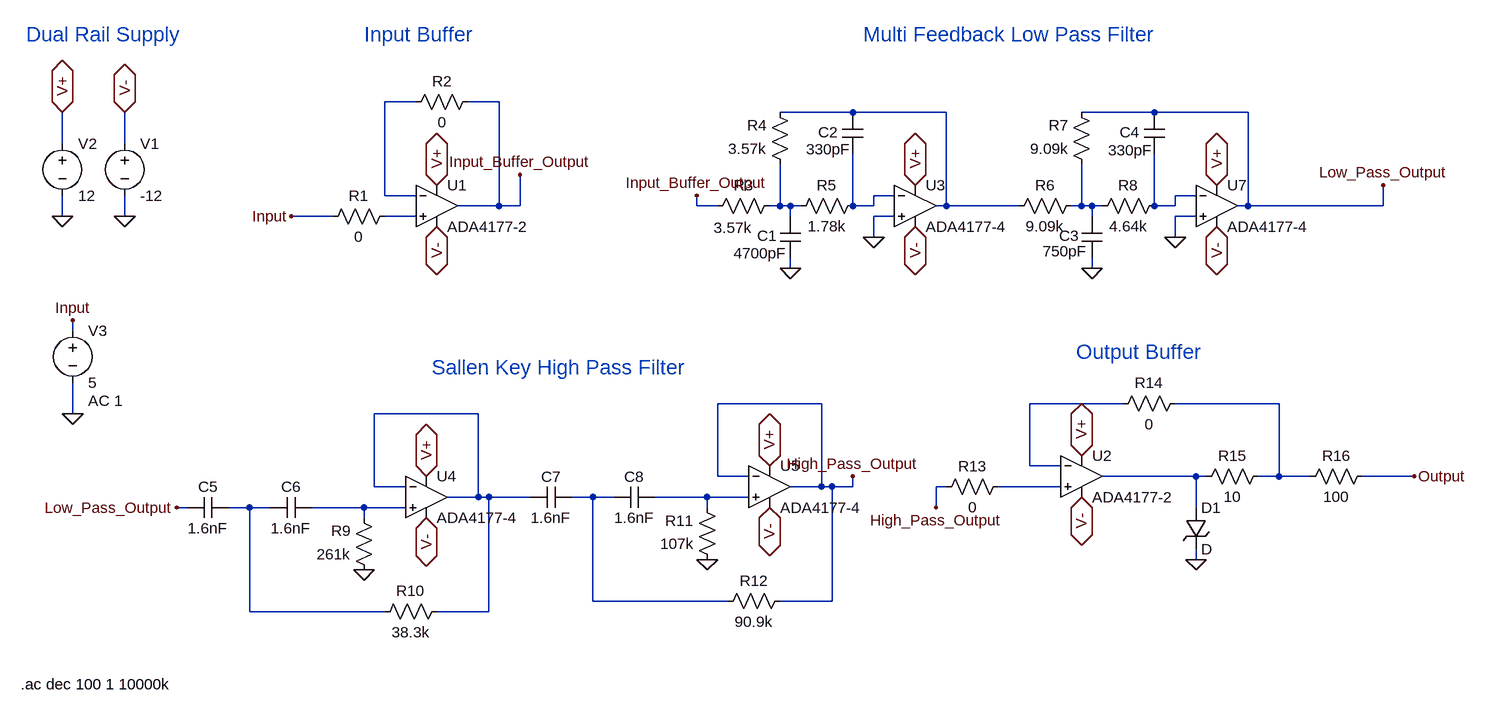
[diagram p0: schematic 8thOrderBandpassFilter.asc]
8thOrderBandpassFilter.asc, the LTspice schematic file:
Version 4.1
SHEET 1 1944 872
WIRE -192 -48 -240 -48
WIRE -64 -48 -112 -48
WIRE 480 -32 368 -32
WIRE 624 -32 480 -32
WIRE 944 -32 832 -32
WIRE 1088 -32 944 -32
WIRE -736 16 -736 -32
WIRE -640 16 -640 -32
WIRE -240 96 -240 -48
WIRE -192 96 -240 96
WIRE 544 96 512 96
WIRE 1008 96 976 96
WIRE -64 112 -64 -48
WIRE -64 112 -128 112
WIRE -32 112 -32 64
WIRE -32 112 -64 112
WIRE 240 112 240 96
WIRE 272 112 240 112
WIRE 368 112 368 48
WIRE 368 112 352 112
WIRE 384 112 368 112
WIRE 400 112 384 112
WIRE 480 112 480 32
WIRE 512 112 512 96
WIRE 512 112 480 112
WIRE 624 112 624 -32
WIRE 624 112 608 112
WIRE 736 112 624 112
WIRE 832 112 832 48
WIRE 832 112 816 112
WIRE 848 112 832 112
WIRE 864 112 848 112
WIRE 944 112 944 32
WIRE 976 112 976 96
WIRE 976 112 944 112
WIRE 1088 112 1088 -32
WIRE 1088 112 1072 112
WIRE 1296 112 1296 80
WIRE 1296 112 1088 112
WIRE -736 128 -736 96
WIRE -640 128 -640 96
WIRE -320 128 -384 128
WIRE -192 128 -240 128
WIRE 384 128 384 112
WIRE 544 128 512 128
WIRE 848 128 848 112
WIRE 1008 128 976 128
WIRE 512 160 512 128
WIRE 976 160 976 128
WIRE 384 208 384 192
WIRE 848 208 848 192
WIRE -720 304 -720 288
WIRE 432 416 272 416
WIRE 896 416 752 416
WIRE 1136 416 976 416
WIRE -720 432 -720 384
WIRE -96 432 -256 432
WIRE 752 512 752 416
WIRE 800 512 752 512
WIRE 272 528 272 416
WIRE 320 528 272 528
WIRE 1008 528 864 528
WIRE 1024 528 1008 528
WIRE 1136 528 1136 416
WIRE 1136 528 1104 528
WIRE 1184 528 1136 528
WIRE 1344 528 1264 528
WIRE -256 544 -256 432
WIRE -208 544 -256 544
WIRE 432 544 432 416
WIRE 432 544 384 544
WIRE 448 544 432 544
WIRE 480 544 480 528
WIRE 480 544 448 544
WIRE 624 544 608 544
WIRE 800 544 704 544
WIRE -96 560 -96 432
WIRE -96 560 -144 560
WIRE -80 560 -96 560
WIRE -16 560 -80 560
WIRE 80 560 48 560
WIRE 112 560 80 560
WIRE 256 560 176 560
WIRE 320 560 256 560
WIRE -544 576 -560 576
WIRE -448 576 -480 576
WIRE -416 576 -448 576
WIRE -272 576 -352 576
WIRE -208 576 -272 576
WIRE 256 576 256 560
WIRE 608 576 608 544
WIRE 1008 576 1008 528
WIRE -272 592 -272 576
WIRE 1008 656 1008 640
WIRE 80 720 80 560
WIRE 288 720 80 720
WIRE 448 720 448 544
WIRE 448 720 368 720
WIRE -448 736 -448 576
WIRE -240 736 -448 736
WIRE -80 736 -80 560
WIRE -80 736 -160 736
FLAG -736 128 0
FLAG -640 128 0
FLAG -736 -32 V+
IOPIN -736 -32 BiDir
FLAG -640 -32 V-
IOPIN -640 -32 BiDir
FLAG -160 80 V+
IOPIN -160 80 BiDir
FLAG 576 80 V+
IOPIN 576 80 BiDir
FLAG -176 528 V+
IOPIN -176 528 BiDir
FLAG 832 496 V+
IOPIN 832 496 BiDir
FLAG -160 144 V-
IOPIN -160 144 BiDir
FLAG 576 144 V-
IOPIN 576 144 BiDir
FLAG -176 592 V-
IOPIN -176 592 BiDir
FLAG 832 560 V-
IOPIN 832 560 BiDir
FLAG -384 128 Input
FLAG 512 160 0
FLAG 384 208 0
FLAG 1040 80 V+
IOPIN 1040 80 BiDir
FLAG 1040 144 V-
IOPIN 1040 144 BiDir
FLAG 976 160 0
FLAG 848 208 0
FLAG -272 672 0
FLAG 1296 80 Low_Pass_Output
FLAG -560 576 Low_Pass_Output
FLAG -32 64 Input_Buffer_Output
FLAG 240 96 Input_Buffer_Output
FLAG 352 512 V+
IOPIN 352 512 BiDir
FLAG 352 576 V-
IOPIN 352 576 BiDir
FLAG 256 656 0
FLAG 1008 656 0
FLAG 1344 528 Output
FLAG 480 528 High_Pass_Output
FLAG 608 576 High_Pass_Output
FLAG -720 288 Input
FLAG -720 432 0
SYMBOL OpAmps\\ADA4177-4 576 112 R0
SYMATTR InstName U3
SYMBOL OpAmps\\ADA4177-4 -176 560 R0
SYMATTR InstName U4
SYMBOL OpAmps\\ADA4177-2 -160 112 R0
SYMATTR InstName U1
SYMBOL OpAmps\\ADA4177-2 832 528 R0
SYMATTR InstName U2
SYMBOL voltage -640 0 R0
WINDOW 123 24 124 Left 2
WINDOW 39 0 0 Left 0
SYMATTR InstName V1
SYMATTR Value -12
SYMBOL voltage -736 0 R0
WINDOW 123 24 124 Left 2
WINDOW 39 0 0 Left 0
SYMATTR InstName V2
SYMATTR Value 12
SYMBOL res -336 144 R270
WINDOW 0 32 56 VTop 2
WINDOW 3 0 56 VBottom 2
SYMATTR InstName R1
SYMATTR Value 0
SYMBOL res -208 -32 R270
WINDOW 0 32 56 VTop 2
WINDOW 3 0 56 VBottom 2
SYMATTR InstName R2
SYMATTR Value 0
SYMBOL res 256 128 R270
WINDOW 0 32 56 VTop 2
WINDOW 3 -2 40 VBottom 2
SYMATTR InstName R3
SYMATTR Value 3.57k
SYMBOL res 384 64 R180
WINDOW 0 36 76 Left 2
WINDOW 3 36 40 Left 2
SYMATTR InstName R4
SYMATTR Value 3.57k
SYMBOL res 384 128 R270
WINDOW 0 32 56 VTop 2
WINDOW 3 0 56 VBottom 2
SYMATTR InstName R5
SYMATTR Value 1.78k
SYMBOL cap 400 192 R180
WINDOW 0 36 34 Left 2
WINDOW 3 21 7 Left 2
SYMATTR InstName C1
SYMATTR Value 4700pF
SYMBOL cap 464 -32 R0
WINDOW 0 -37 31 Left 2
WINDOW 3 -56 57 Left 2
SYMATTR InstName C2
SYMATTR Value 330pF
SYMBOL OpAmps\\ADA4177-4 1040 112 R0
SYMATTR InstName U7
SYMBOL res 720 128 R270
WINDOW 0 32 56 VTop 2
WINDOW 3 0 56 VBottom 2
SYMATTR InstName R6
SYMATTR Value 9.09k
SYMBOL res 848 64 R180
WINDOW 0 36 76 Left 2
WINDOW 3 36 40 Left 2
SYMATTR InstName R7
SYMATTR Value 9.09k
SYMBOL res 848 128 R270
WINDOW 0 32 56 VTop 2
WINDOW 3 0 56 VBottom 2
SYMATTR InstName R8
SYMATTR Value 4.64k
SYMBOL cap 864 192 R180
WINDOW 0 36 34 Left 2
WINDOW 3 23 10 Left 2
SYMATTR InstName C3
SYMATTR Value 750pF
SYMBOL cap 928 -32 R0
WINDOW 0 -37 31 Left 2
WINDOW 3 -55 58 Left 2
SYMATTR InstName C4
SYMATTR Value 330pF
SYMBOL res -256 752 R270
WINDOW 0 32 56 VTop 2
WINDOW 3 0 56 VBottom 2
SYMATTR InstName R10
SYMATTR Value 38.3k
SYMBOL res -256 688 R180
WINDOW 0 36 76 Left 2
WINDOW 3 36 40 Left 2
SYMATTR InstName R9
SYMATTR Value 261k
SYMBOL cap -480 560 R90
WINDOW 0 0 32 VBottom 2
WINDOW 3 32 32 VTop 2
SYMATTR InstName C5
SYMATTR Value 1.6nF
SYMBOL cap -352 560 R90
WINDOW 0 0 32 VBottom 2
WINDOW 3 32 32 VTop 2
SYMATTR InstName C6
SYMATTR Value 1.6nF
SYMBOL OpAmps\\ADA4177-4 352 544 R0
SYMATTR InstName U5
SYMBOL res 272 736 R270
WINDOW 0 32 56 VTop 2
WINDOW 3 0 56 VBottom 2
SYMATTR InstName R12
SYMATTR Value 90.9k
SYMBOL res 272 672 R180
WINDOW 0 36 76 Left 2
WINDOW 3 36 40 Left 2
SYMATTR InstName R11
SYMATTR Value 107k
SYMBOL cap 48 544 R90
WINDOW 0 0 32 VBottom 2
WINDOW 3 32 32 VTop 2
SYMATTR InstName C7
SYMATTR Value 1.6nF
SYMBOL cap 176 544 R90
WINDOW 0 0 32 VBottom 2
WINDOW 3 32 32 VTop 2
SYMATTR InstName C8
SYMATTR Value 1.6nF
SYMBOL res 608 560 R270
WINDOW 0 32 56 VTop 2
WINDOW 3 0 56 VBottom 2
SYMATTR InstName R13
SYMATTR Value 0
SYMBOL res 880 432 R270
WINDOW 0 32 56 VTop 2
WINDOW 3 0 56 VBottom 2
SYMATTR InstName R14
SYMATTR Value 0
SYMBOL res 1008 544 R270
WINDOW 0 32 56 VTop 2
WINDOW 3 0 56 VBottom 2
SYMATTR InstName R15
SYMATTR Value 10
SYMBOL res 1168 544 R270
WINDOW 0 32 56 VTop 2
WINDOW 3 0 56 VBottom 2
SYMATTR InstName R16
SYMATTR Value 100
SYMBOL TVSdiode 992 576 R0
SYMATTR InstName D1
SYMBOL voltage -720 288 R0
WINDOW 123 24 124 Left 2
WINDOW 39 0 0 Left 0
SYMATTR Value2 AC 1
SYMATTR InstName V3
SYMATTR Value 5
TEXT 496 -152 Left 3 ;Multi Feedback Low Pass Filter
TEXT -272 -152 Left 3 ;Input Buffer
TEXT -792 -152 Left 3 ;Dual Rail Supply
TEXT -168 360 Left 3 ;Sallen Key High Pass Filter
TEXT 824 336 Left 3 ;Output Buffer
TEXT -800 848 Left 2 !.ac dec 100 1 10000k

The netlist it stands for:
* 8thOrderBandpassFilter.asc
* U3: ADA4177-4 (symbol OpAmps\ADA4177-4 not available, pins judged from their places): In+=0 In-=N003 V+=V+ V-=V- OUT=N002
* U4: ADA4177-4 (symbol OpAmps\ADA4177-4 not available, pins judged from their places): In+=N016 In-=N010 V+=V+ V-=V- OUT=N010
* U1: ADA4177-2 (symbol OpAmps\ADA4177-2 not available, pins judged from their places): In+=N007 In-=N001 V+=V+ V-=V- OUT=Input_Buffer_Output
* U2: ADA4177-2 (symbol OpAmps\ADA4177-2 not available, pins judged from their places): In+=N012 In-=N008 V+=V+ V-=V- OUT=N011
V1 V- 0 -12
V2 V+ 0 12
R1 Input N007 0
R2 N001 Input_Buffer_Output 0
R3 Input_Buffer_Output N005 3.57k
R4 N005 N002 3.57k
R5 N005 N003 1.78k
C1 0 N005 4700pF
C2 N002 N003 330pF
* U7: ADA4177-4 (symbol OpAmps\ADA4177-4 not available, pins judged from their places): In+=0 In-=N004 V+=V+ V-=V- OUT=Low_Pass_Output
R6 N002 N006 9.09k
R7 N006 Low_Pass_Output 9.09k
R8 N006 N004 4.64k
C3 0 N006 750pF
C4 Low_Pass_Output N004 330pF
R10 N015 N010 38.3k
R9 0 N016 261k
C5 N015 Low_Pass_Output 1.6nF
C6 N016 N015 1.6nF
* U5: ADA4177-4 (symbol OpAmps\ADA4177-4 not available, pins judged from their places): In+=N014 In-=High_Pass_Output V+=V+ V-=V- OUT=High_Pass_Output
R12 N013 High_Pass_Output 90.9k
R11 0 N014 107k
C7 N013 N010 1.6nF
C8 N014 N013 1.6nF
R13 High_Pass_Output N012 0
R14 N008 N009 0
R15 N011 N009 10
R16 N009 Output 100
D1 N011 0 D
V3 Input 0 5 AC 1
.model D D
.lib standard.dio
* Multi Feedback Low Pass Filter
* Input Buffer
* Dual Rail Supply
* Sallen Key High Pass Filter
* Output Buffer
.ac dec 100 1 10000k
.backanno
.end